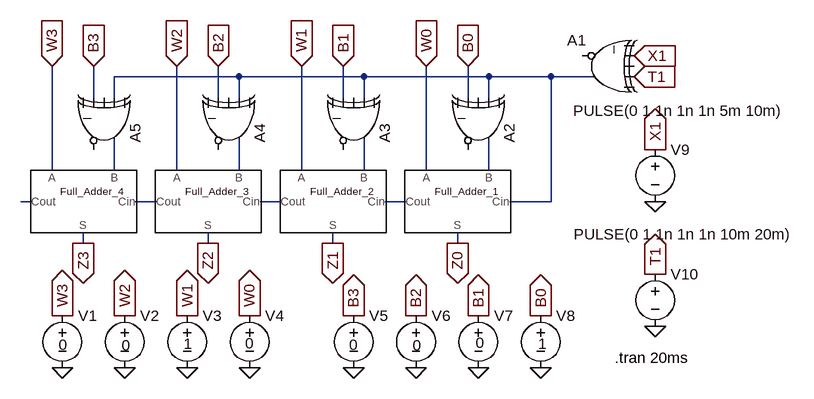
[diagram p0: schematic Training_Perceptron.asc]
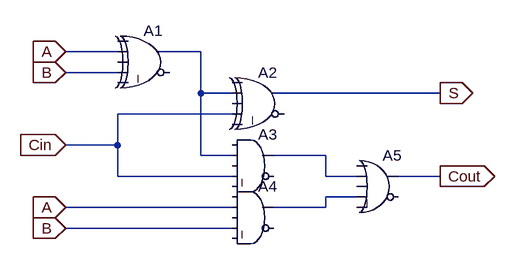
[diagram p1: sub-circuit full_adder.asc]
Training_Perceptron.asc, the LTspice schematic file:
Version 4
SHEET 1 1152 680
WIRE 128 -48 -64 -48
WIRE 320 -48 128 -48
WIRE 512 -48 320 -48
WIRE 608 -48 512 -48
WIRE 672 -48 608 -48
WIRE -96 -16 -96 -64
WIRE -64 -16 -64 -48
WIRE 96 -16 96 -64
WIRE 128 -16 128 -48
WIRE 288 -16 288 -64
WIRE 320 -16 320 -48
WIRE 480 -16 480 -64
WIRE 512 -16 512 -48
WIRE -160 96 -160 -64
WIRE -64 96 -64 48
WIRE 32 96 32 -64
WIRE 128 96 128 48
WIRE 224 96 224 -64
WIRE 320 96 320 48
WIRE 416 96 416 -64
WIRE 512 96 512 48
WIRE -192 144 -208 144
WIRE 0 144 -32 144
WIRE 192 144 160 144
WIRE 384 144 352 144
WIRE 608 144 608 -48
WIRE 608 144 544 144
WIRE -112 208 -112 192
WIRE 80 208 80 192
WIRE 272 208 272 192
WIRE 464 208 464 192
FLAG -160 -64 W3
IOPIN -160 -64 In
FLAG -96 -64 B3
IOPIN -96 -64 In
FLAG 32 -64 W2
IOPIN 32 -64 In
FLAG 96 -64 B2
IOPIN 96 -64 In
FLAG 224 -64 W1
IOPIN 224 -64 In
FLAG 288 -64 B1
IOPIN 288 -64 In
FLAG 416 -64 W0
IOPIN 416 -64 In
FLAG 480 -64 B0
IOPIN 480 -64 In
FLAG 736 -80 X1
IOPIN 736 -80 In
FLAG 736 -48 T1
IOPIN 736 -48 In
FLAG -112 208 Z3
IOPIN -112 208 Out
FLAG 80 208 Z2
IOPIN 80 208 Out
FLAG 272 208 Z1
IOPIN 272 208 Out
FLAG 464 208 Z0
IOPIN 464 208 Out
FLAG -144 320 W3
IOPIN -144 320 Out
FLAG -48 320 W2
IOPIN -48 320 Out
FLAG 48 320 W1
IOPIN 48 320 Out
FLAG 144 320 W0
IOPIN 144 320 Out
FLAG 304 320 B3
IOPIN 304 320 Out
FLAG 400 320 B2
IOPIN 400 320 Out
FLAG 496 320 B1
IOPIN 496 320 Out
FLAG 592 320 B0
IOPIN 592 320 Out
FLAG -144 400 0
FLAG -48 400 0
FLAG 48 400 0
FLAG 144 400 0
FLAG 304 400 0
FLAG 400 400 0
FLAG 496 400 0
FLAG 592 400 0
FLAG 768 144 0
FLAG 768 336 0
FLAG 768 64 X1
IOPIN 768 64 Out
FLAG 768 256 T1
IOPIN 768 256 Out
SYMBOL Full_Adder 464 144 R0
SYMATTR InstName Full_Adder_1
SYMBOL Full_Adder 272 144 R0
SYMATTR InstName Full_Adder_2
SYMBOL Full_Adder 80 144 R0
SYMATTR InstName Full_Adder_3
SYMBOL Full_Adder -112 144 R0
SYMATTR InstName Full_Adder_4
SYMBOL Digital\\xor 560 32 R90
SYMATTR InstName A2
SYMBOL Digital\\xor 368 32 R90
SYMATTR InstName A3
SYMBOL Digital\\xor 176 32 R90
SYMATTR InstName A4
SYMBOL Digital\\xor -16 32 R90
SYMATTR InstName A5
SYMBOL Digital\\xor 688 0 R180
WINDOW 0 26 104 Left 2
SYMATTR InstName A1
SYMBOL voltage -144 304 R0
WINDOW 3 -6 60 Left 2
WINDOW 123 0 0 Left 0
WINDOW 39 0 0 Left 0
SYMATTR Value 0
SYMATTR InstName V1
SYMBOL voltage -48 304 R0
WINDOW 3 -5 61 Left 2
WINDOW 123 0 0 Left 0
WINDOW 39 0 0 Left 0
SYMATTR Value 0
SYMATTR InstName V2
SYMBOL voltage 48 304 R0
WINDOW 3 -5 59 Left 2
WINDOW 123 0 0 Left 0
WINDOW 39 0 0 Left 0
SYMATTR Value 1
SYMATTR InstName V3
SYMBOL voltage 144 304 R0
WINDOW 3 -7 58 Left 2
WINDOW 123 0 0 Left 0
WINDOW 39 0 0 Left 0
SYMATTR Value 0
SYMATTR InstName V4
SYMBOL voltage 304 304 R0
WINDOW 3 -7 60 Left 2
WINDOW 123 0 0 Left 0
WINDOW 39 0 0 Left 0
SYMATTR Value 0
SYMATTR InstName V5
SYMBOL voltage 400 304 R0
WINDOW 3 -5 61 Left 2
WINDOW 123 0 0 Left 0
WINDOW 39 0 0 Left 0
SYMATTR Value 0
SYMATTR InstName V6
SYMBOL voltage 496 304 R0
WINDOW 3 -4 57 Left 2
WINDOW 123 0 0 Left 0
WINDOW 39 0 0 Left 0
SYMATTR Value 0
SYMATTR InstName V7
SYMBOL voltage 592 304 R0
WINDOW 3 -4 59 Left 2
WINDOW 123 0 0 Left 0
WINDOW 39 0 0 Left 0
SYMATTR Value 1
SYMATTR InstName V8
SYMBOL voltage 768 48 R0
WINDOW 3 -126 -44 Left 2
WINDOW 123 0 0 Left 0
WINDOW 39 0 0 Left 0
SYMATTR Value PULSE(0 1 1n 1n 1n 5m 10m)
SYMATTR InstName V9
SYMBOL voltage 768 240 R0
WINDOW 3 -125 -46 Left 2
WINDOW 123 0 0 Left 0
WINDOW 39 0 0 Left 0
SYMATTR Value PULSE(0 1 1n 1n 1n 10m 20m)
SYMATTR InstName V10
TEXT 706 384 Left 2 !.tran 20ms

full_adder.asc, the sub-circuit schematic file:
Version 4
SHEET 1 880 680
WIRE 64 48 -16 48
WIRE 192 48 128 48
WIRE 64 80 -16 80
WIRE 192 112 192 48
WIRE 240 112 192 112
WIRE 560 112 304 112
WIRE 240 144 64 144
WIRE 64 192 64 144
WIRE 64 192 -16 192
WIRE 192 208 192 112
WIRE 240 208 192 208
WIRE 384 208 304 208
WIRE 64 240 64 192
WIRE 240 240 64 240
WIRE 384 240 384 208
WIRE 432 240 384 240
WIRE 560 240 496 240
WIRE 432 272 384 272
WIRE 240 288 -16 288
WIRE 384 288 384 272
WIRE 384 288 304 288
WIRE 240 320 -16 320
FLAG -16 48 A
IOPIN -16 48 In
FLAG -16 80 B
IOPIN -16 80 In
FLAG -16 192 Cin
IOPIN -16 192 In
FLAG -16 288 A
IOPIN -16 288 In
FLAG -16 320 B
IOPIN -16 320 In
FLAG 560 112 S
IOPIN 560 112 Out
FLAG 560 240 Cout
IOPIN 560 240 Out
SYMBOL Digital\\xor 112 0 R0
SYMATTR InstName A1
SYMBOL Digital\\xor 288 64 R0
SYMATTR InstName A2
SYMBOL Digital\\and 272 160 R0
SYMATTR InstName A3
SYMBOL Digital\\and 272 240 R0
SYMATTR InstName A4
SYMBOL Digital\\or 464 192 R0
SYMATTR InstName A5

The netlist it stands for:
* Training_Perceptron.asc
XFull_Adder_1 W0 N005 N009 N001 Z0 full_adder
XFull_Adder_2 W1 N004 N008 N009 Z1 full_adder
XFull_Adder_3 W2 N003 N007 N008 Z2 full_adder
XFull_Adder_4 W3 N002 N006 N007 Z3 full_adder
A2 0 N001 0 B0 0 0 N005 0 XOR
A3 0 N001 0 B1 0 0 N004 0 XOR
A4 0 N001 0 B2 0 0 N003 0 XOR
A5 0 N001 0 B3 0 0 N002 0 XOR
A1 0 T1 0 X1 0 0 N001 0 XOR
V1 W3 0 0
V2 W2 0 0
V3 W1 0 1
V4 W0 0 0
V5 B3 0 0
V6 B2 0 0
V7 B1 0 0
V8 B0 0 1
V9 X1 0 PULSE(0 1 1n 1n 1n 5m 10m)
V10 T1 0 PULSE(0 1 1n 1n 1n 10m 20m)

* block symbol definitions
.subckt full_adder A B Cout Cin S
A1 0 A 0 B 0 0 N001 0 XOR
A2 0 N001 0 Cin 0 0 S 0 XOR
A3 0 N001 0 Cin 0 0 N002 0 AND
A4 0 A 0 B 0 0 N003 0 AND
A5 0 N002 0 N003 0 0 Cout 0 OR
.ends full_adder

.tran 20ms
.backanno
.end